# Altium schematic sheet EPS.SchDoc
size A4; SheetNumber: 1; SheetTotal: 7
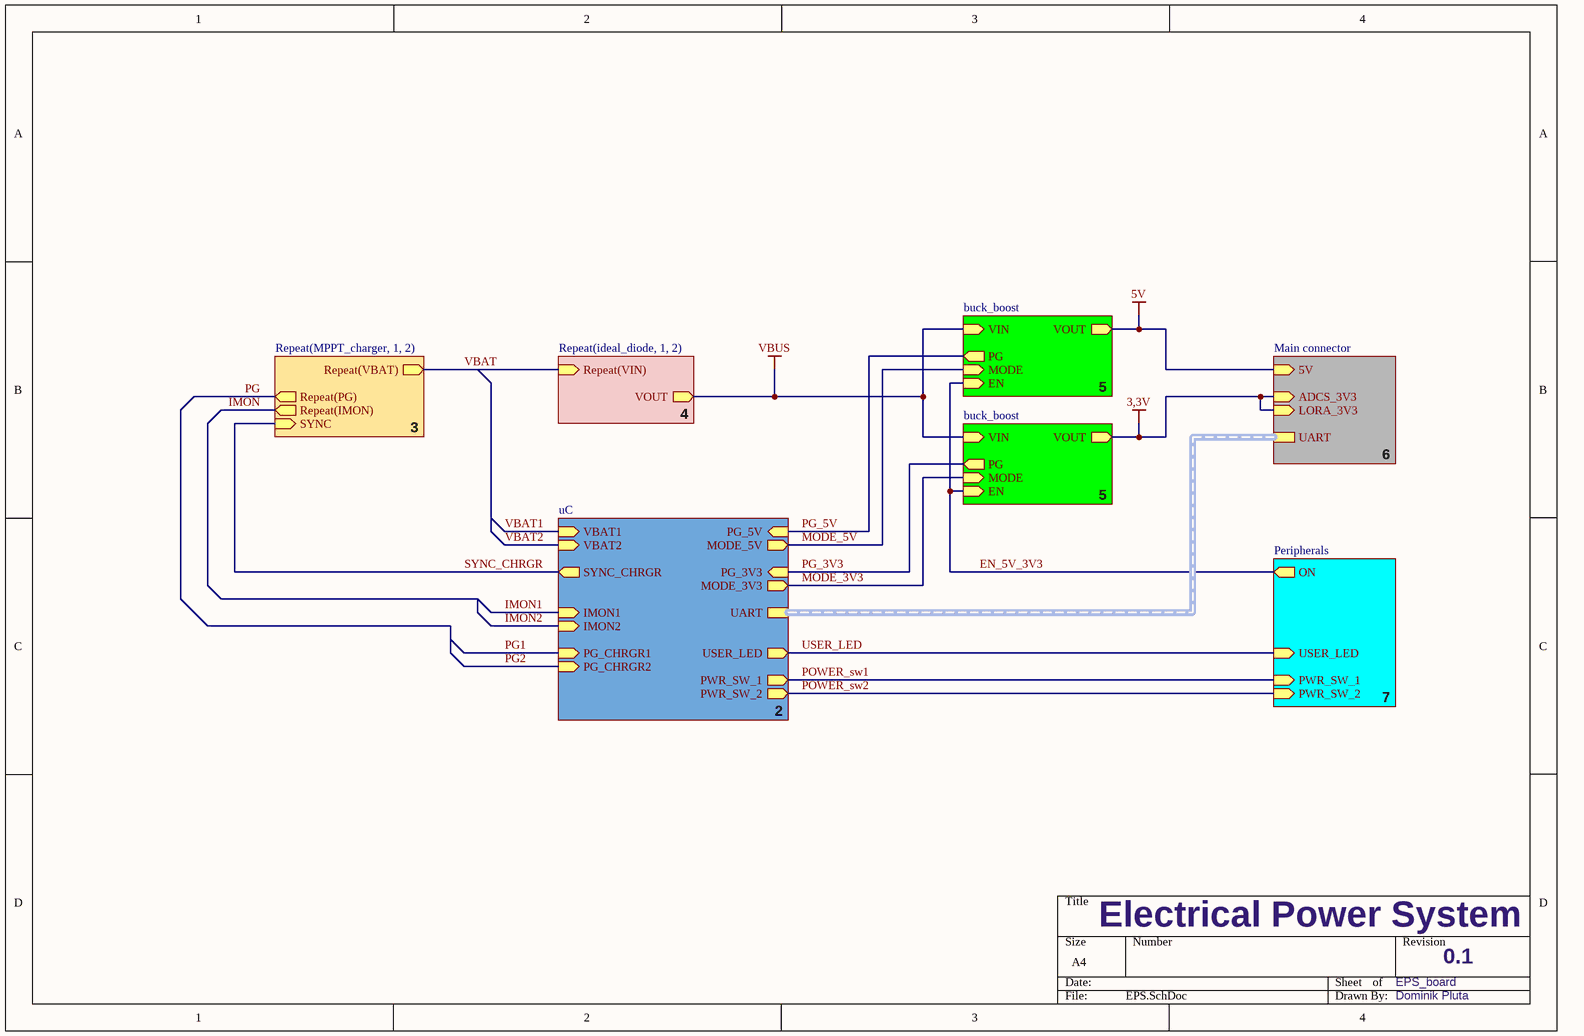
[diagram p0: EPS.SchDoc]

## Sub-sheets
buck_boost = buck_boost.SchDoc: VIN (in), EN (in), MODE (in), VOUT (out), PG (out)
buck_boost = buck_boost.SchDoc: VIN (in), EN (in), MODE (in), VOUT (out), PG (out)
Main connector = main_connector.SchDoc: 5V (in), ADCS_3V3 (in), LORA_3V3 (in), UART (harness UART)
Peripherals = peripherals.SchDoc: ON (out), PWR_SW_1 (in), PWR_SW_2 (in), USER_LED (in)
Repeat(ideal_diode, 1, 2) = ideal_diode.SchDoc: VOUT (out), Repeat(VIN) (in)
Repeat(MPPT_charger, 1, 2) = MPPT_charger.SchDoc: Repeat(PG) (out), Repeat(IMON) (out), Repeat(VBAT) (out), SYNC (in)
uC = uC.SchDoc: VBAT1 (in), VBAT2 (in), USER_LED (out), MODE_5V (out), PG_5V (in), MODE_3V3 (out), PG_3V3 (in), IMON1 (in), PG_CHRGR1 (in), SYNC_CHRGR (out), IMON2 (in), PG_CHRGR2 (in), UART (harness UART), PWR_SW_1 (out), PWR_SW_2 (out)

## Nets
3,3V: sheet buck_boost/VOUT, sheet Main connector/ADCS_3V3, sheet Main connector/LORA_3V3
5V: sheet buck_boost/VOUT, sheet Main connector/5V
VBUS: sheet buck_boost/VIN, sheet buck_boost/VIN, sheet Repeat(ideal_diode, 1, 2)/VOUT
EN_5V_3V3: sheet buck_boost/EN, sheet buck_boost/EN, sheet Peripherals/ON
IMON: sheet Repeat(MPPT_charger, 1, 2)/Repeat(IMON)
IMON1: sheet uC/IMON1
IMON2: sheet uC/IMON2
MODE_3V3: sheet uC/MODE_3V3, sheet buck_boost/MODE
MODE_5V: sheet uC/MODE_5V, sheet buck_boost/MODE
PG: sheet Repeat(MPPT_charger, 1, 2)/Repeat(PG)
PG1: sheet uC/PG_CHRGR1
PG2: sheet uC/PG_CHRGR2
PG_3V3: sheet uC/PG_3V3, sheet buck_boost/PG
PG_5V: sheet uC/PG_5V, sheet buck_boost/PG
POWER_sw1: sheet uC/PWR_SW_1, sheet Peripherals/PWR_SW_1
POWER_sw2: sheet uC/PWR_SW_2, sheet Peripherals/PWR_SW_2
SYNC_CHRGR: sheet uC/SYNC_CHRGR, sheet Repeat(MPPT_charger, 1, 2)/SYNC
USER_LED: sheet uC/USER_LED, sheet Peripherals/USER_LED
VBAT: sheet Repeat(MPPT_charger, 1, 2)/Repeat(VBAT), sheet Repeat(ideal_diode, 1, 2)/Repeat(VIN)
VBAT1: sheet uC/VBAT1
VBAT2: sheet uC/VBAT2

## Buses and harness runs
harness sheet Main connector/UART = sheet uC/UART

## Notes on the sheet
- 3
- 4
- 5
- 6
- 2
- 7
- Electrical Power System
- EPS_board
- 0.1
- Dominik Pluta